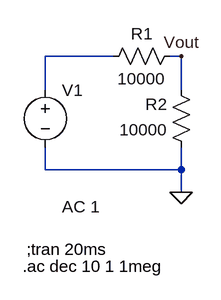
[diagram p0: schematic Task 1 AC.asc]
Task 1 AC.asc, the LTspice schematic file:
Version 4
SHEET 1 880 680
WIRE 240 64 144 64
WIRE 336 64 320 64
WIRE 144 112 144 64
WIRE 336 112 336 64
WIRE 144 224 144 192
WIRE 336 224 336 192
WIRE 336 224 144 224
WIRE 336 256 336 224
FLAG 336 256 0
FLAG 336 64 Vout
SYMBOL res 336 48 R90
WINDOW 0 0 56 VBottom 2
WINDOW 3 32 56 VTop 2
SYMATTR InstName R1
SYMATTR Value 10000
SYMBOL res 352 208 R180
WINDOW 0 36 76 Left 2
WINDOW 3 36 40 Left 2
SYMATTR InstName R2
SYMATTR Value 10000
SYMBOL voltage 144 96 R0
WINDOW 3 24 152 Left 2
WINDOW 123 24 180 Left 2
WINDOW 39 24 124 Left 2
SYMATTR InstName V1
SYMATTR Value ""
SYMATTR Value2 AC 1
TEXT 118 336 Left 2 !;tran 20ms
TEXT 112 360 Left 2 !.ac dec 10 1 1meg

The netlist it stands for:
* Task 1 AC.asc
R1 Vout N001 10000
R2 0 Vout 10000
V1 N001 0 AC 1
;tran 20ms
.ac dec 10 1 1meg
.backanno
.end